# Altium schematic sheet H-Bridge.SchDoc
size A4
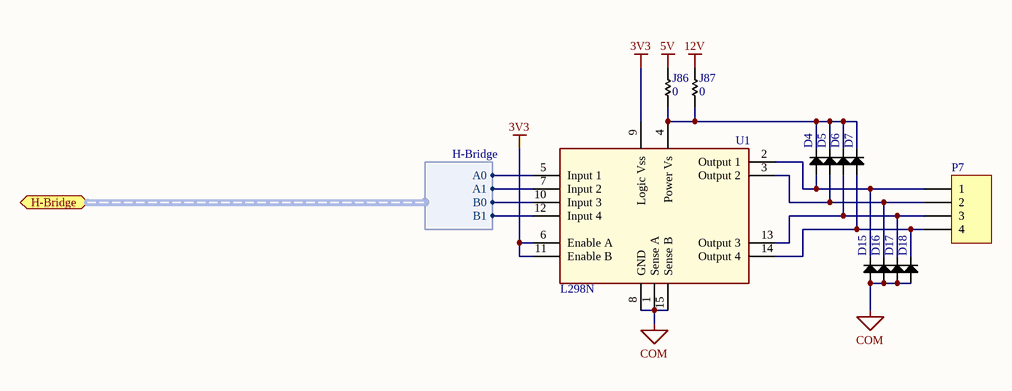
[diagram p0: H-Bridge.SchDoc]

## Parts
D4  Diode  [DOS-214AC (SMA)]  (value not drawn)
D5  Diode  [DOS-214AC (SMA)]  (value not drawn)
D6  Diode  [DOS-214AC (SMA)]  (value not drawn)
D7  Diode  [DOS-214AC (SMA)]  (value not drawn)
D15  Diode  [DOS-214AC (SMA)]  (value not drawn)
D16  Diode  [DOS-214AC (SMA)]  (value not drawn)
D17  Diode  [DOS-214AC (SMA)]  (value not drawn)
D18  Diode  [DOS-214AC (SMA)]  (value not drawn)
J86  value 0  [0805 - Resistor]  (hidden comment: Res)
J87  value 0  [0805 - Resistor]  (hidden comment: Res)
P7  Header 1X4  [Headers - 1x4 - Vertical - Lock]  (value not drawn)
U1  L298N  [Multiwatt_15]

## Ports
H-Bridge (harness H-Bridge)

## Harnesses
H-Bridge: A0, A1, B0, B1

## Nets
3V3: U1.6(Enable_A) U1.9(Logic_Vss) U1.11(Enable_B)
5V: J86.2
12V: J87.2
COM: D15.1(A) D16.1(A) D17.1(A) D18.1(A) U1.1(Sense_A) U1.8(GND) U1.15(Sense_B)
NetD4_1: D4.1(A) D15.2(K) P7.1 U1.2(Output_1)
NetD4_2: D4.2(K) D5.2(K) D6.2(K) D7.2(K) J86.1 J87.1 U1.4(Power_Vs)
NetD5_1: D5.1(A) D16.2(K) P7.2 U1.3(Output_2)
NetD6_1: D6.1(A) D17.2(K) P7.3 U1.13(Output_3)
NetD7_1: D7.1(A) D18.2(K) P7.4 U1.14(Output_4)
NetU1_5: U1.5(Input_1) ; port H-Bridge.A0
NetU1_7: U1.7(Input_2) ; port H-Bridge.A1
NetU1_10: U1.10(Input_3) ; port H-Bridge.B0
NetU1_12: U1.12(Input_4) ; port H-Bridge.B1

## Library data of the parts
D4-D7 D15-D18 = S1M-13-F: DIODE GEN PURPOSE 1000V 1A SMA; Manufacturer: Diodes Inc.; Manufacturer No: BAS21LT3G; Sub Category: Single; Voltage: 1.1V @ 1A; Part Number: S1M-13-F; Category: Diode; Pin count: 2; Package: SMA; Supplier 1: Digi-Key; Supplier Part Number 1: S1M-FDICT-ND; ComponentLink1URL: http://www.diodes.com/datasheets/ds16003.pdf; ComponentLink1Description: Datasheet; Creation Date: 2013-10-21 20:14:01; Created by: Pier-Yves; Value: SMA; Current: 1A; Temperature: -55°C ~ 150°C
J86 J87 = Jumper-0805: RES 0.0 OHM 1/8W JUMP 0805; Manufacturer: Stackpole electronic; Manufacturer No: RMCF0805ZT0R00; Sub Category: 0805; Current: 2A; Part Number: Jumper-0805; Category: Resistor; Pin count: 2; Package: 0805; Series: RMFC; Supplier 1: Digi-Key; Supplier Part Number 1: RMCF0805ZT0R00CT-ND; ComponentLink1URL: http://www.seielect.com/Catalog/SEI-RMCF_RMCP.pdf; ComponentLink1Description: Datasheet; Creation Date: 2013-09-21 02:33:24; Created by: Pier-Yves; Power: 1/8W; Height: 0.65mm
P7 = Header-0.100-Vertical-Lock-1X4: CONN HEADER 4POS .100" STR TIN; Manufacturer: Molex Inc; Manufacturer No: 90136-1104; Sub Category: 100mils Vertical lock; Value: 4 pins; LatestRevisionDate: 17-Jul-2002; LatestRevisionNote: Re-released for DXP Platform.; Publisher: Altium Limited; Part Number: Header-0.100-Vertical-Lock-1X4; Category: Header; Pin count: 4; Series: C-Grid III 90136; Supplier 1: Digi-Key; Supplier Part Number 1: WM8215-ND; ComponentLink1URL: http://www.molex.com/pdm_docs/sd/901361104_sd.pdf; ComponentLink1Description: Datasheet; Creation Date: 2013-11-05 17:17:54; Created by: Pier-Yves; Height: 10.9mm
U1 = L298N: IC BRIDGE DRIVER PAR 15MULTIWATT; Manufacturer: STMicroelectronics; Sub Category: Bridges; Power: 25; Voltage: 4.8 V ~ 46 V; Current: 2A; Date: 2012-10-10; Part Number: L298N; Category: IC; Pin count: 15; Package: Multiwatt15; Manufacturer No: L298N; Supplier 1: Digi-Key; Supplier Part Number 1: 497-1395-5-ND; ComponentLink1URL: http://www.st.com/web/en/resource/technical/document/datasheet/CD00000240.pdf; ComponentLink1Description: Datasheet; Created by: Pier-Yves; Temperature: -25°C ~ 130°C